# EAGLE design WD1M_BTLE_JDY-08 (EAGLE 7.5.0)
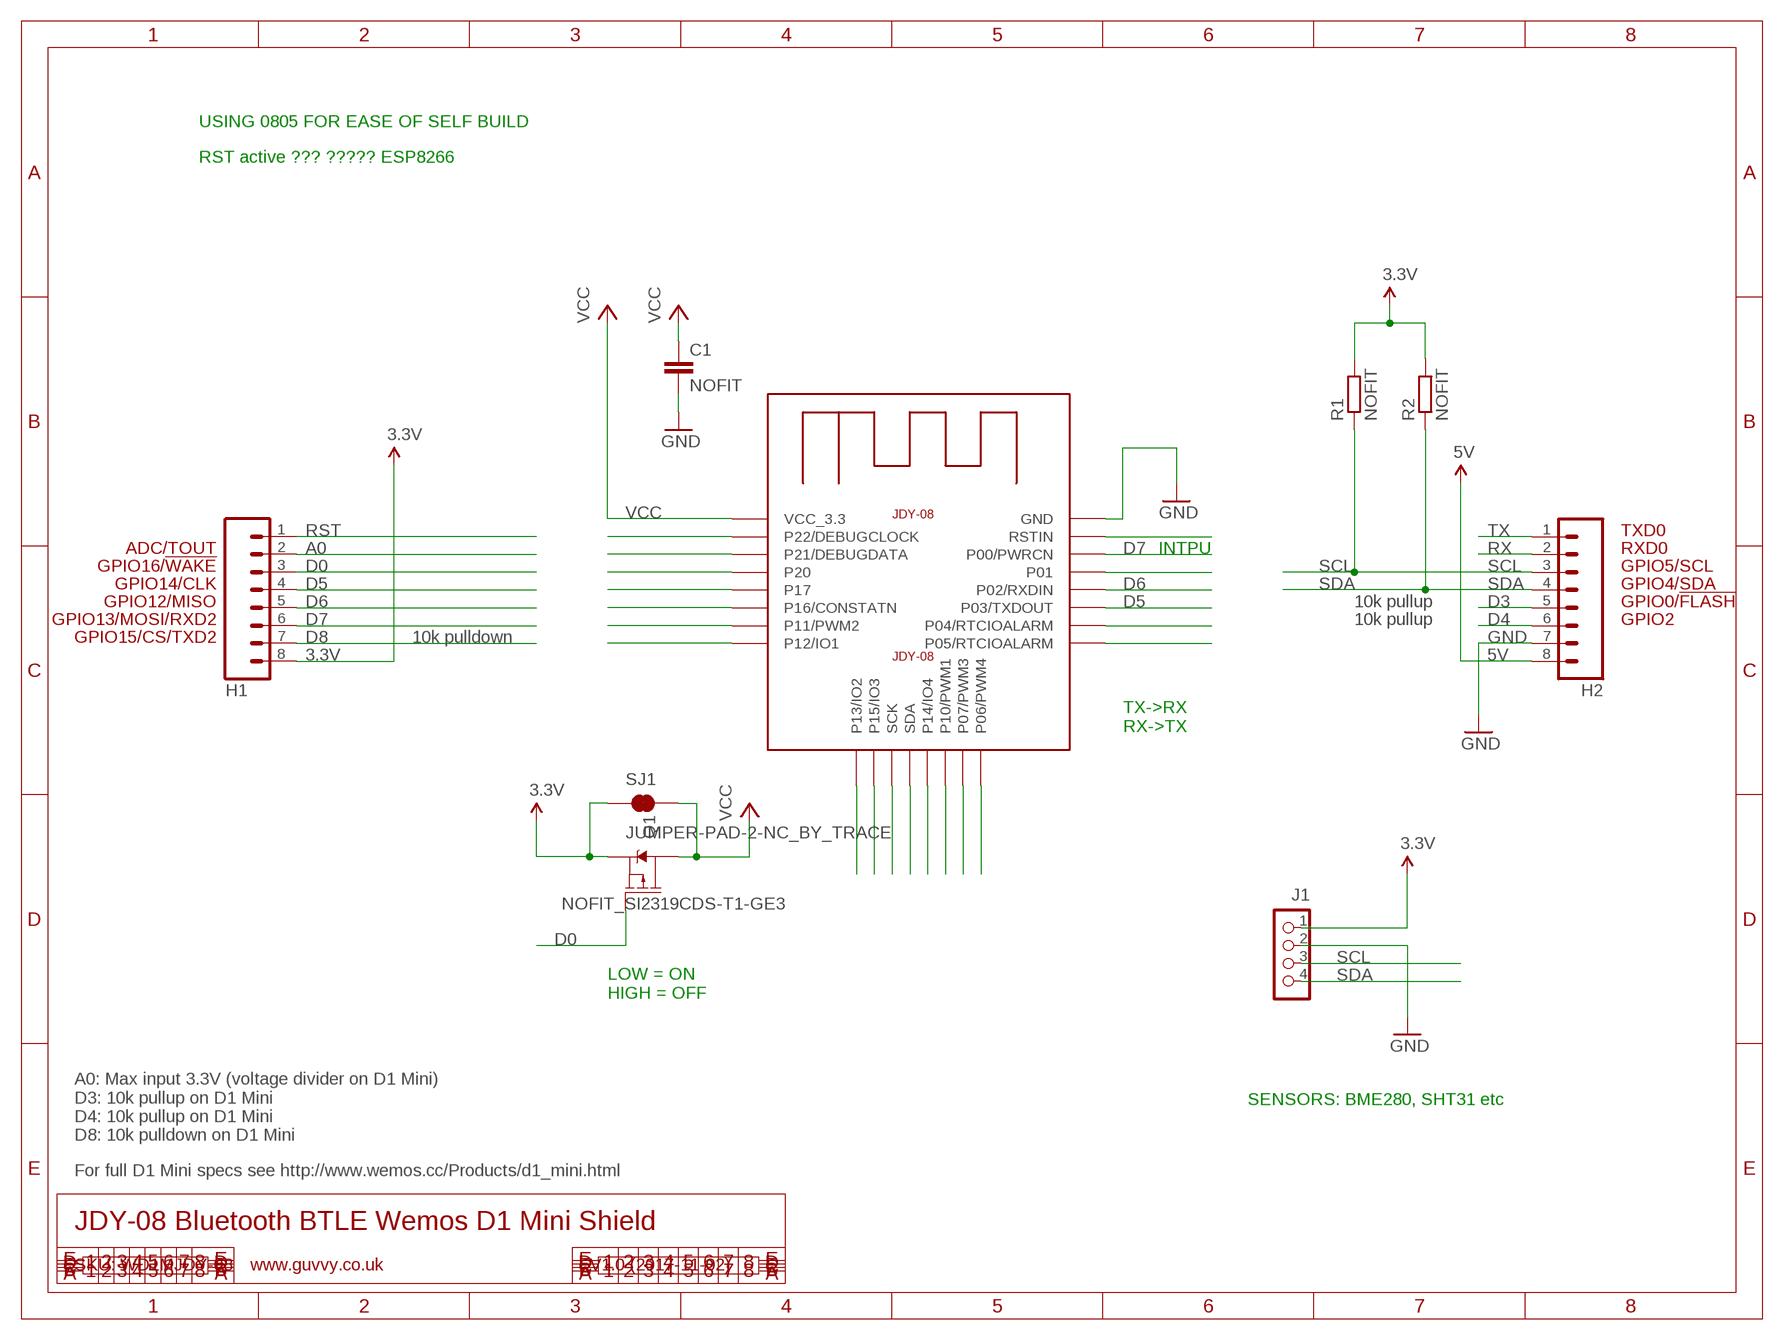
[diagram p0: schematic, sheet 1]

## Parts
C1  NOFIT  C-EUC0805K  [C0805K]
H1  M08  [1X08]
H2  M08  [1X08]
J1  CON_HEADER_1X04  [M1X4]
Q1  NOFIT_SI2319CDS-T1-GE3  MOSFET_PCH-IRLML2244  [SOT23-3]
R1  NOFIT  R-EU_R0805  [R0805]
R2  NOFIT  R-EU_R0805  [R0805]
SJ1  JUMPER-PAD-2-NC_BY_TRACE  [PAD-JUMPER-2-NC_BY_TRACE_YES_SILK]
U$2  JDY-08  [JDY-08]

## Nets
3.3V: H1.8 J1.1 Q1.2(S) R1.2 R2.2 SJ1.1
5V: H2.8
A0: H1.2
D0: H1.3 Q1.1(G)
D3: H2.5
D4: H2.6
D5: H1.4 U$2.P03/TXDOUT
D6: H1.5 U$2.P02/RXDIN
D7: H1.6 U$2.P00/PWRCN
D8: H1.7
GND: C1.2 H2.7 J1.2 U$2.GND
N$2: U$2.RSTIN
N$3: U$2.P22/DEBUGCLOCK
N$4: U$2.P21/DEBUGDATA
N$5: U$2.P20
N$6: U$2.P17
N$7: U$2.P16/CONSTATN
N$8: U$2.P11/PWM2
N$9: U$2.P12/IO1
N$11: U$2.P01
N$14: U$2.P04/RTCALARMIO(P04/RTCIOALARM)
N$15: U$2.P05/RTCALARMIO(P05/RTCIOALARM)
N$16: U$2.P13/IO2
N$17: U$2.P15/IO3
N$18: U$2.SCK
N$19: U$2.SDA
N$20: U$2.P14/IO4
N$21: U$2.P10/PWM1
N$22: U$2.P07/PWM3
N$23: U$2.P06/PWM4
RST: H1.1
RX: H2.2
SCL: H2.3 J1.3 R1.1
SDA: H2.4 J1.4 R2.1
TX: H2.1
VCC: C1.1 Q1.3(D) SJ1.2 U$2.VCC_3.3

## Notes on the sheet
- USING 0805 FOR EASE OF SELF BUILD
- RST active ??? ????? ESP8266
- TXD0
- ADC/TOUT | INTPU | RXD0
- GPIO16/!WAKE | GPIO5/SCL
- GPIO14/CLK | GPIO4/SDA
- GPIO12/MISO | 10k pullup | GPIO0/!FLASH
- GPIO13/MOSI/RXD2 | 10k pullup | GPIO2
- GPIO15/CS/TXD2 | 10k pulldown
- TX->RX
  RX->TX
- LOW = ON
  HIGH = OFF
- SENSORS: BME280, SHT31 etc
- A0: Max input 3.3V (voltage divider on D1 Mini)
  D3: 10k pullup on D1 Mini
  D4: 10k pullup on D1 Mini
  D8: 10k pulldown on D1 Mini
- For full D1 Mini specs see http://www.wemos.cc/Products/d1_mini.html
- JDY-08 Bluetooth BTLE Wemos D1 Mini Shield
- SKU: WD1MJDY-08 | www.guvvy.co.uk | V1.0 (2017-11-02)

## Library data of the parts
C1 = rcl:C-EU: CAPACITOR, European symbol
H1 H2 = freetronics-original:M08: Header 8 Standard 8-pin 0.1" header. Use with straight break away headers (SKU : PRT-00116), right angle break away headers (PRT-00553), swiss pins (PRT-00743), machine pins (PRT-00117), and female headers (PRT-00115).
J1 = dp_devices:CON_HEADER_1X04
Q1 = SparkFun-DiscreteSemi:MOSFET_PCH: P-channel MOSFETs Voltage controlled devices that allow control of high current outputs. SparkFun Products: SparkFun ESP32 Thing <https://www.sparkfun.com/products/13907> SparkFun ESP8266 Thing <https://www.sparkfun.com/products/13231>; PROD_ID: TRANS-11153; VALUE: 4.3A/20V/54mΩ
R1 R2 = rcl:R-EU_: RESISTOR, European symbol
SJ1 = SparkFun-Passives:JUMPER-PAD-2-NC_BY_TRACE
U$2 = JDY-08:JDY-08: JDY-08 Bluetooth 4.0 Transceiver based on TI CC2540/CC2541

## Net classes
0 default: width 0.203 mm, drill 0.356 mm, clearance 0.152 mm
1 power: width 0.203 mm, clearance 0.152 mm

## Board
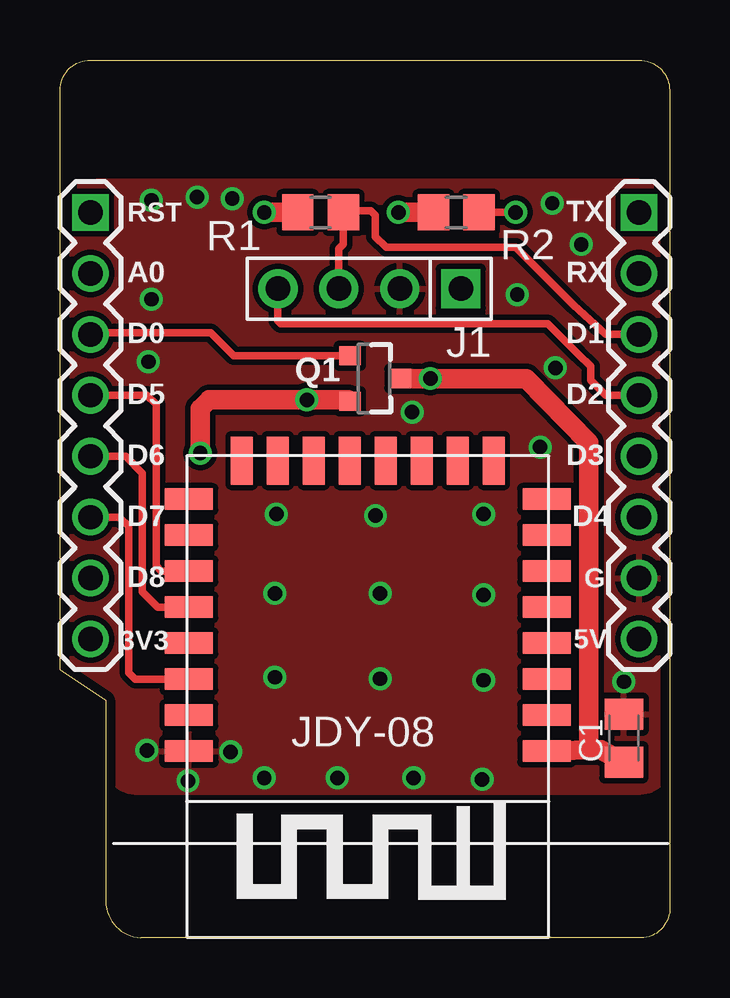
[diagram p1: board, top side]
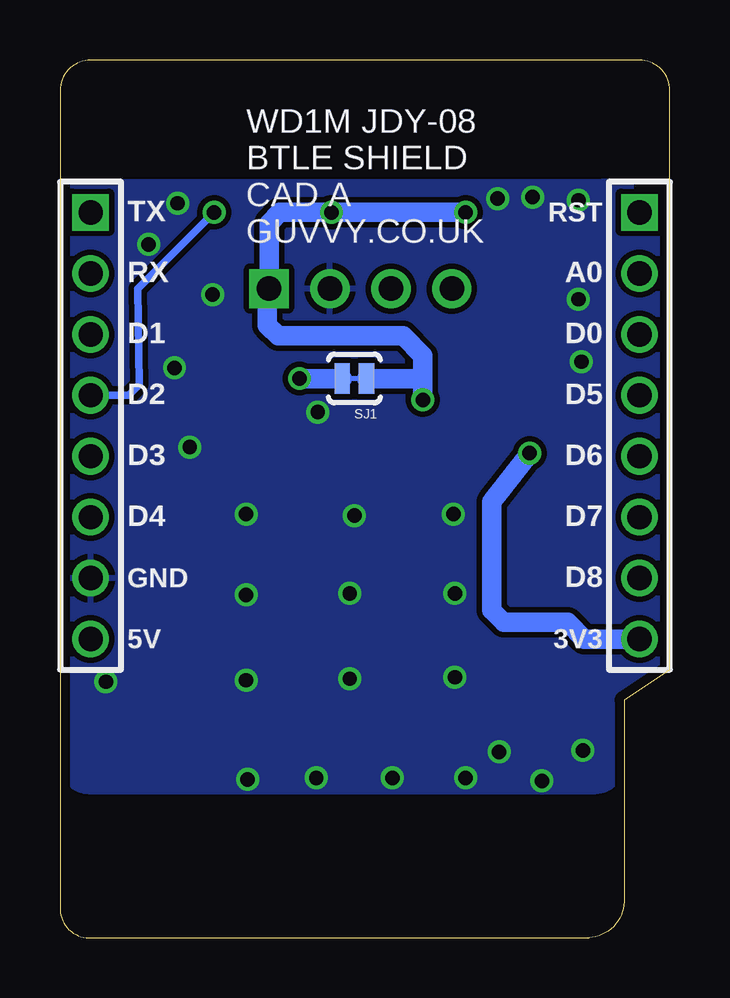
[diagram p2: board, bottom side, seen from below]

Size 25.41 x 36.58 mm. Coordinates in mm from the lower left corner, seen from the top.
Outline: 25.4,35.31 25.4,1.4 arc-90 24.32,0 3.37,0 arc-90 1.9,1.65 1.9,9.91 0,11.18 0,35.31 arc-90 1.27,36.58 24.13,36.58 arc-90 25.4,35.31
Copper layers (1*16): Top 0.0356mm / dielectric 1.5011mm / Bottom 0.0356mm
Design rules "oshpark-2layer": minimum track width 6mil, minimum drill 13mil, track to track 6mil, track to pad 6mil, pad to pad 6mil, via to via 6mil, smd to smd 6mil, copper to edge 15mil, drill to drill 6mil, minimum pad ring 7mil, minimum via ring 7mil, stop-mask expansion 2.5mil, vias tented up to drill 0mil, thermal gap 10mil

### Footprints (pad centres in the part's own frame; a part is rotated, then mirrored left to right if it is on the bottom)
C0805K = smd 1.3 x 1.6: 1 -1,0; 2 1,0
1X08 = drill 1.016 square: 1 0,0 | drill 1.016: 2 2.54,0; 3 5.08,0; 4 7.62,0; 5 10.16,0; 6 12.7,0; 7 15.24,0; 8 17.78,0
M1X4 = drill 1.02 pad 1.632 square: 1 0,0 | drill 1.02 pad 1.632: 2 2.54,0; 3 5.08,0; 4 7.62,0
SOT23-3 = smd 0.8 x 0.9: 1 -0.95,-1; 2 0.95,-1; 3 0,1.1
R0805 = smd 1.3 x 1.5: 1 -0.95,0; 2 0.95,0
PAD-JUMPER-2-NC_BY_TRACE_YES_SILK = smd 0.635 x 1.27: 1 -0.508,0; 2 0.508,0
JDY-08 = smd 2 x 0.9: GND 7.2,6; P00/PWRCN 7.2,3; P01 7.2,1.5; P02/RXDIN 7.2,0; P03/TXDOUT 7.2,-1.5; P04/RTCALARMIO 7.2,-3; P05/RTCALARMIO 7.2,-4.5; P11/PWM2 -7.7,-3; P12/IO1 -7.7,-4.5; P16/CONSTATN -7.7,-1.5; P17 -7.7,0; P20 -7.7,1.5; P21/DEBUGDATA -7.7,3; P22/DEBUGCLOCK -7.7,4.5; RSTIN 7.2,4.5; VCC_3.3 -7.7,6 | smd 0.9 x 2: P06/PWM4 5,-6.1; P07/PWM3 3.5,-6.1; P10/PWM1 2,-6.1; P13/IO2 -5.5,-6.1; P14/IO4 0.5,-6.1; P15/IO3 -4,-6.1; SCK -2.5,-6.1; SDA -1,-6.1

### Placement (x,y rotation side)
C1  23.5,8.32 90 top
H1  1.27,30.23 270 top
H2  24.13,30.23 270 top
J1  16.7,27.05 180 top
Q1  13.08,23.3 270 top
R1  10.86,30.23 180 top
R2  16.51,30.23 180 top
SJ1  13.14,23.3 180 bottom
U$2  12.57,13.78 180 top

### Tracks (layer width: path | path; a pad name or v marks a point on that pad's centre or on a via)
3.3V  (via drill 0.6)
  Top 0.813: v5.84,20.19 5.84,22.03 6.22,22.41 v10.29,22.41 12.02,22.41 Q1.2 | R1.2 v8.51,30.23 | v14.1,30.23 R2.2
  Bottom 0.813: v5.84,20.19 7.43,18.16 7.43,13.65 6.92,13.15 4.25,13.15 3.56,12.45 H1.8 | 10.29,23.3 10.29,24.26 11.11,25.08 16.32,25.08 16.76,25.53 16.76,26.99 J1.1 16.7,29.78 16.26,30.23 v14.1,30.23 v8.51,30.23 | 10.29,23.3 v10.29,22.41 | SJ1.1 10.29,23.3
D0
  Top 0.305: Q1.1 7.24,24.25 6.29,25.21 1.33,25.21 H1.3
D5
  Top 0.305: U$2.P03/TXDOUT 4.21,15.28 4,15.49 4,22.22 3.62,22.61 H1.4
D6
  Top 0.305: U$2.P02/RXDIN 4.06,13.78 3.43,14.41 3.43,19.37 2.73,20.07 H1.5
D7
  Top 0.305: U$2.P00/PWRCN 3.13,10.78 2.86,11.05 2.86,17.14 2.48,17.53 H1.6
GND  (via drill 0.6)
  other vias: 23.5,10.67 3.62,7.81 7.11,7.75 5.33,6.54 3.81,30.73 3.81,26.61 3.68,24 14.67,21.91 9.02,17.65 17.65,17.65 17.59,6.6 14.73,6.67 8.51,6.67 11.56,6.67 8.95,14.35 8.95,10.86 17.65,14.29 17.65,10.73 5.71,30.86 20.51,30.61 21.72,28.89 20.64,23.75 13.33,14.35 13.14,17.59 13.33,10.79 20,20.45 19.05,26.8 7.18,30.8
  pour Top (isolate 0.229): 25.4,29.72 arc90 24.13,31.5 1.52,31.5 arc90 0,29.97 0,11.18 1.9,9.91 1.9,7.43 arc90 3.11,6.1 24.07,6.1 arc90 25.4,7.3
  pour Bottom (isolate 0.229): 25.4,7.3 25.4,30.48 arc90 24.64,31.5 3.05,31.5 arc90 0,29.21 0,11.18 1.9,9.91 1.9,7.43 arc90 3.11,6.1 24.07,6.1 arc90
SCL
  Top 0.305: R1.1 11.81,30.16 | H2.3 22.73,25.15 21.4,26.35 18.99,28.77 13.59,28.77 13.14,29.21 13.14,30.1 12.95,30.29 11.87,30.29 R1.1 | J1.3 11.62,28.7 11.81,28.89 R1.1
SDA  (via drill 0.6)
  Top 0.305: R2.1 v18.99,30.23 | J1.4 9.08,25.72 9.21,25.59 20.32,25.59 21.59,24.32 21.6,24.32 22.11,23.81 22.11,23.23 22.73,22.61 H2.4 24.1,22.64
  Bottom 0.305: H2.4 22.54,22.61 22.1,23.05 22.16,27.05 v18.99,30.23
VCC  (via drill 0.6)
  Top 0.813: U$2.VCC_3.3 22.03,7.84 | 22.03,7.84 22.53,7.84 C1.1 | 22.03,7.84 22.03,20.64 19.43,23.3 v15.43,23.3 Q1.3
  Bottom 0.813: SJ1.2 v15.43,23.3

### Text on the board
tPlace: RST | TX | A0 | RX | D0 | D1 | D5 | D2 | D6 | D3 | D7 | D4 | D8 | G | 3V3 | 5V
bPlace: RST | TX | A0 | RX | D0 | D1 | D5 | D2 | D6 | D3 | D7 | D4 | D8 | GND | 3V3 | 5V
bNames: WD1M JDY-08 / BTLE SHIELD / CAD A / GUVVY.CO.UK